# EasyEDA Pro project BLDCV6-nerdyintern.eprj, board PCB1_1
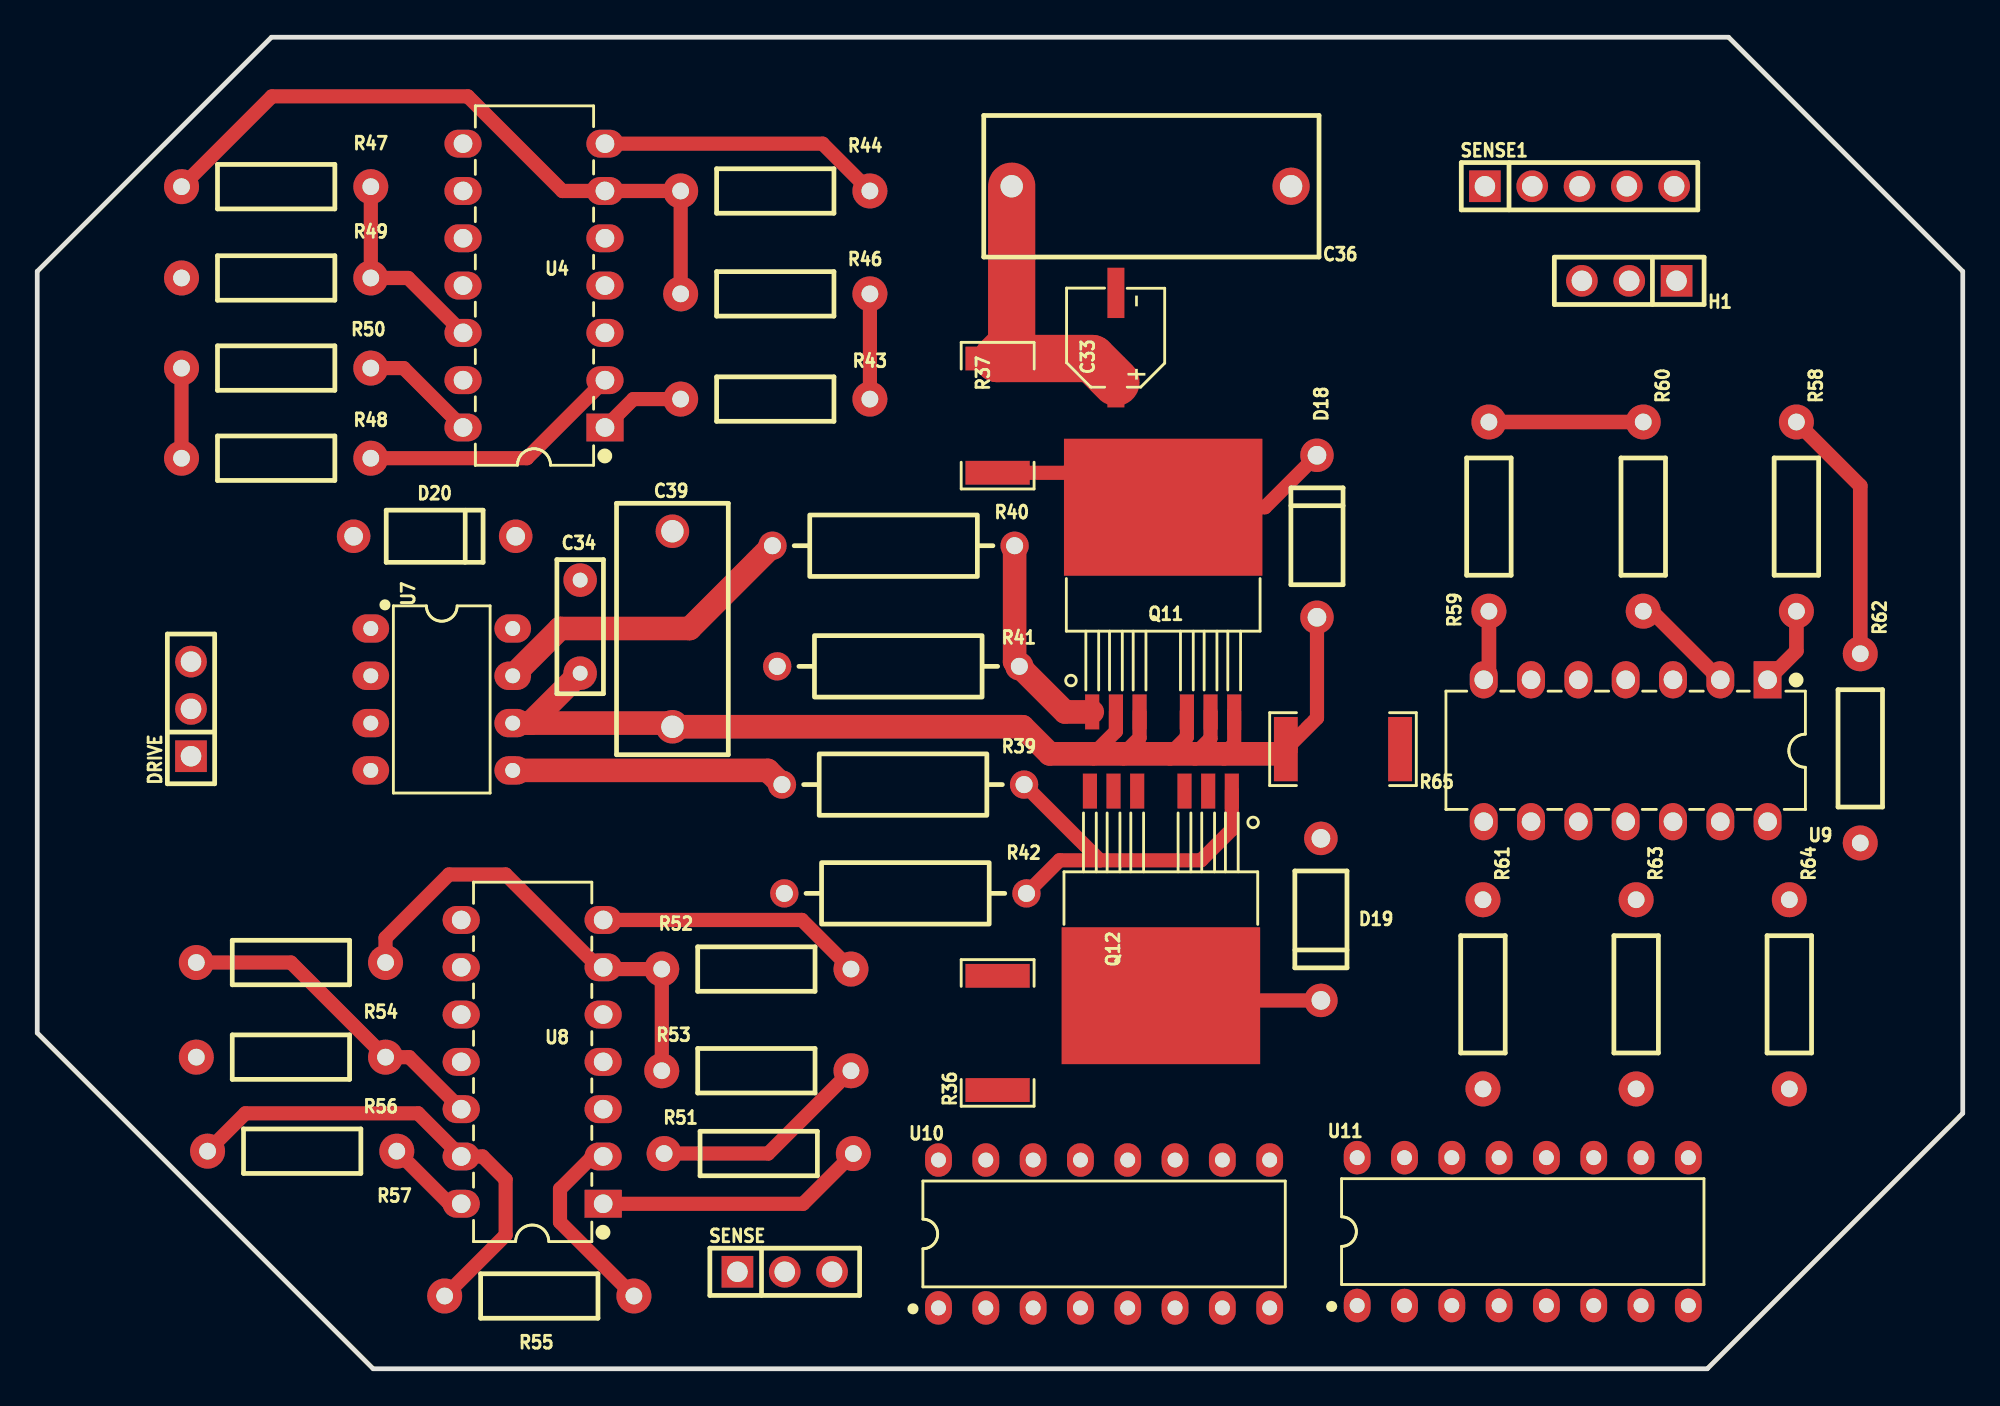
[diagram p13: board, top side]
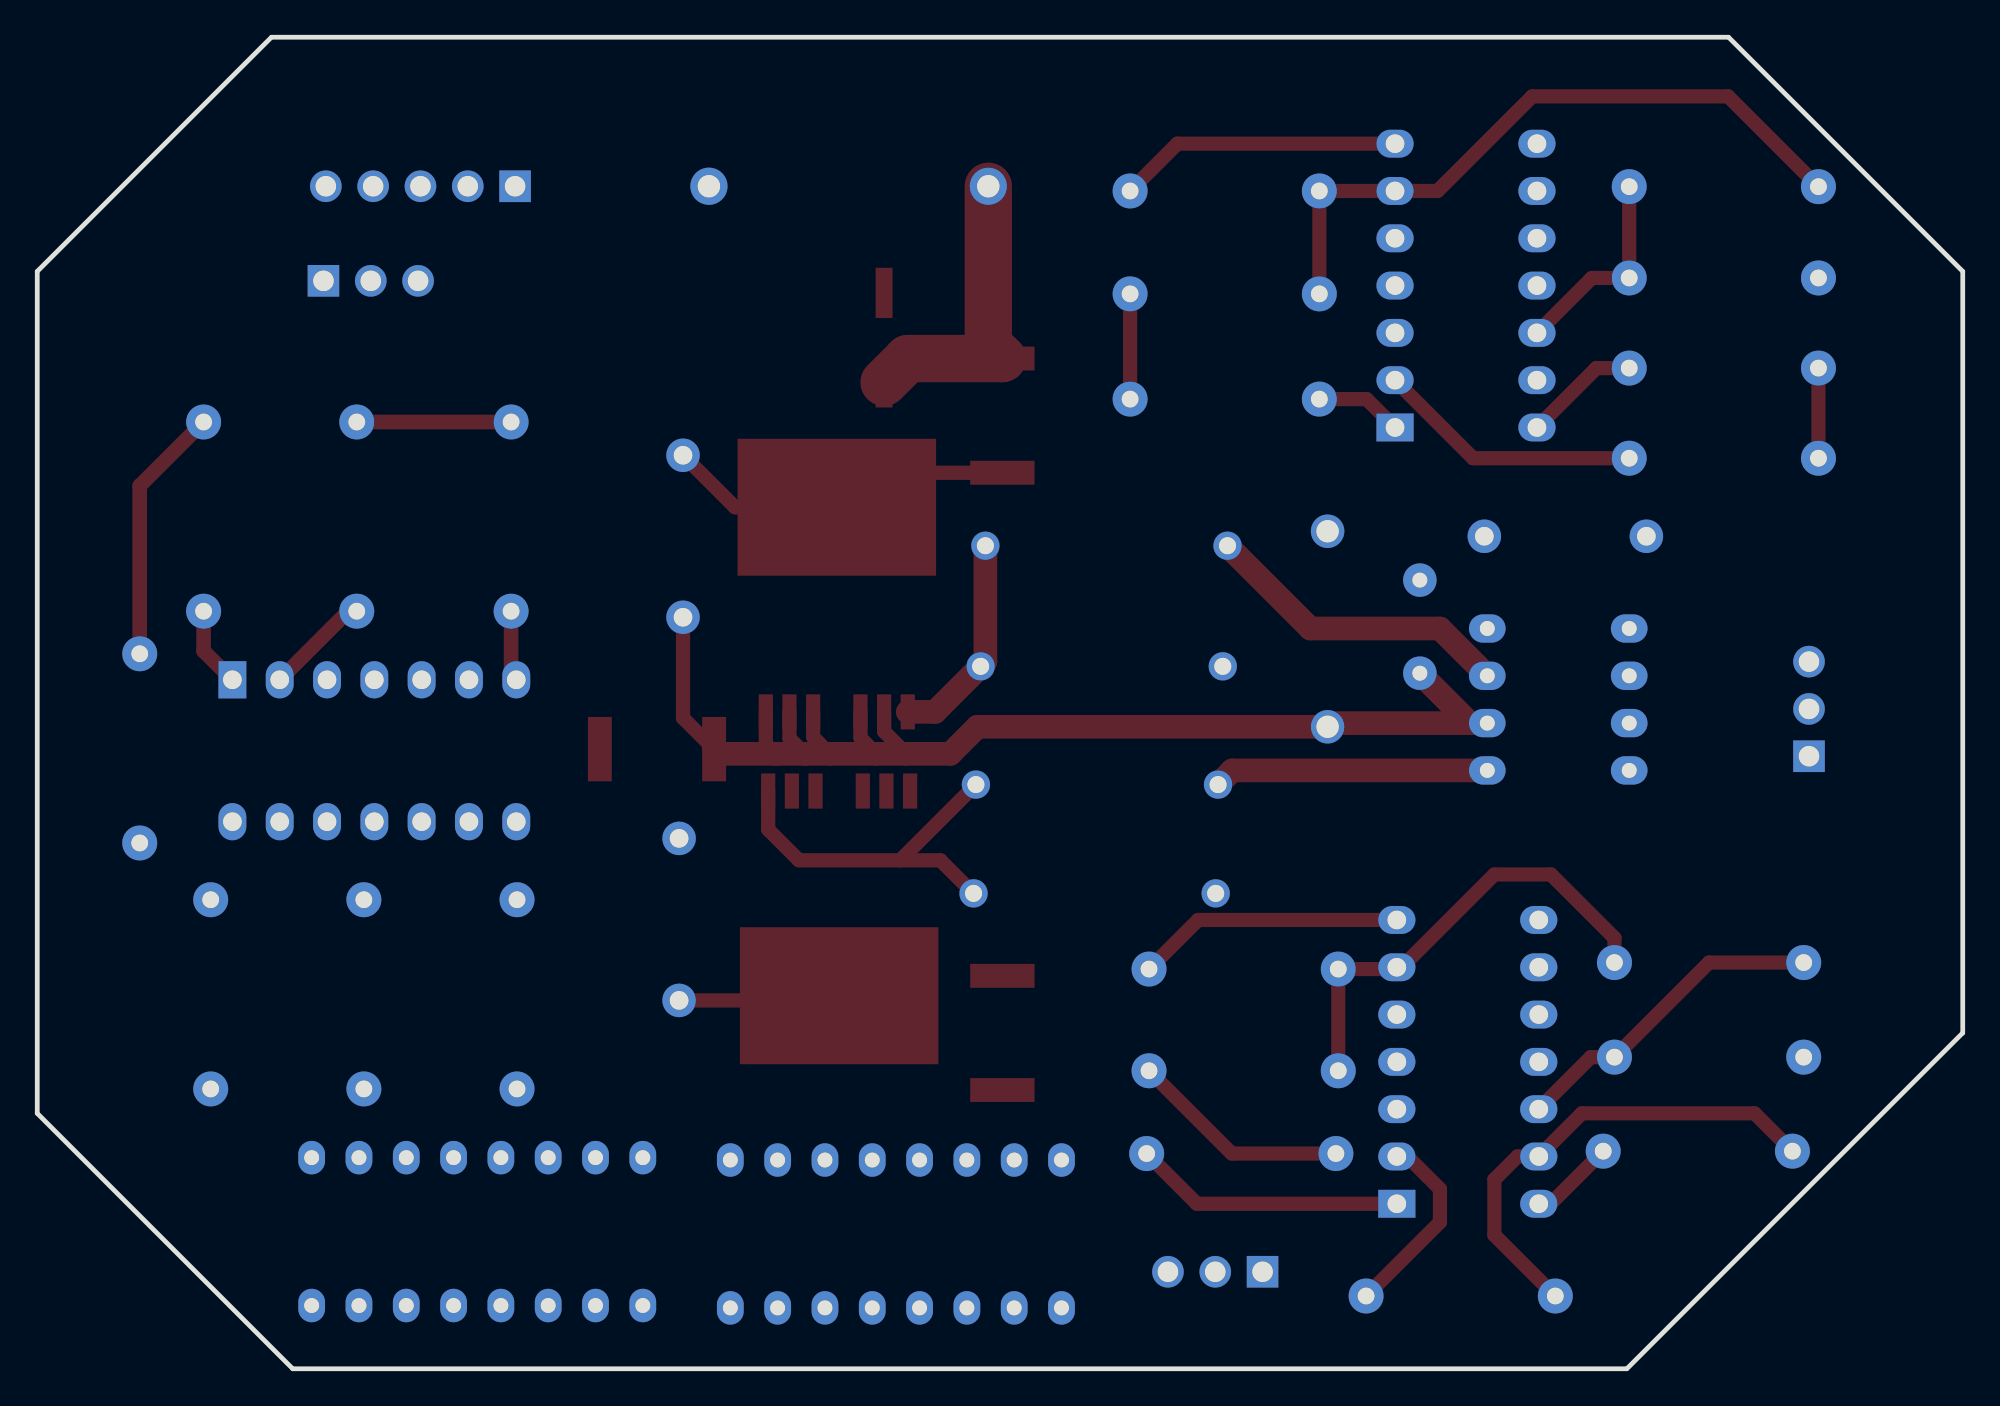
[diagram p14: board, bottom side, seen from below]

Outline 103.38 x 71.5 mm; copper layers: Top Layer, Bottom Layer. Coordinates in mm from the lower left corner of the outline.
Outline path: 0,58.93 0,18.03 18.03,0 89.66,0 103.38,13.72 103.38,58.93 90.8,71.5 12.57,71.5 0,58.93
Stack: Top Layer 0.035mm / Dielectric1 1.51mm FR4 er 4.5 / Bottom Layer 0.035mm

## Design rules (mm)
template: JLCPCB Capability(Two Layers Board)
spacing copperThickness1oz (default): track to track 0.102, other pairs 0.152 to 0.3
spacing copperThickness2oz: track to track 0.203, other pairs 0.152 to 0.3
track width copperThickness1oz (default): min 0.127, default 0.254, max 2.54
track width copperThickness2oz: min 0.203, default 0.254, max 2.54
differential pair differentialPair (default): width min 0.127, default 0.254, max 2.54; gap min 0.152, default 0.152
via viaSize (default): diameter min 0.5, default 0.61, max 10; hole min 0.3, default 0.305, max 6.3

## Placement (name value [footprint] x y rotation side)
C33  10uF  [CAP-SMD_BD5.0-L5.3-W5.3-LS6.3-FD]  57.91 55.37 90 top
C34  1uF  [CAP-TH_L7.2-W2.5-P5.00-D0.6]  29.15 39.85 90 top
C36  330nF  [CAP-TH_L18.0-W7.5-P15.00-D0.8]  59.82 63.5 180 top
C39  15nF  [CAP-TH_L13.5-W5.5-P10.50-D1.2]  34.1 39.72 90 top
D18  -  [DO-41_BD2.4-L4.7-P8.70-D0.9-RD]  68.71 44.7 270 top
D19  -  [DO-41_BD2.4-L4.7-P8.70-D0.9-RD]  68.92 24.13 90 top
D20  -  [DO-41_BD2.4-L4.7-P8.70-D0.9-RD]  21.34 44.7 180 top
DRIVE  -  [HDR-TH_3P-P2.54-V-M]  8.26 35.43 90 top
H1  -  [HDR-TH_3P-P2.54-V-M]  85.47 58.42 180 top
Q11  IRFS7530TRL7PP  [D2PAK-7_L10.6-W9.6-P1.27-LS15.9-BR]  60.45 40.77 270 top
Q12  IRFS7530TRL7PP  [D2PAK-7_L10.6-W9.6-P1.27-LS15.9-BR]  60.33 25.53 90 top
R36  5mΩ  [R2512]  51.56 18.03 90 top
R37  5mΩ  [R2512]  51.56 51.18 90 top
R39  [6-10]  [RES-TH_BD3.3-L9.0-P13.00-D0.6]  46.48 31.37 0 top
R40  [6-10]  [RES-TH_BD3.3-L9.0-P13.00-D0.6]  45.97 44.2 180 top
R41  10k  [RES-TH_BD3.3-L9.0-P13.00-D0.6]  46.23 37.72 180 top
R42  10k  [RES-TH_BD3.3-L9.0-P13.00-D0.6]  46.61 25.53 180 top
R43  10kΩ  [R_AXIAL-0.4]  39.62 52.07 180 top
R44  10kΩ  [R_AXIAL-0.4]  39.62 63.25 180 top
R46  10kΩ  [R_AXIAL-0.4]  39.62 57.72 0 top
R47  10kΩ  [R_AXIAL-0.4]  12.83 63.48 0 top
R48  10kΩ  [R_AXIAL-0.4]  12.83 48.9 180 top
R49  10kΩ  [R_AXIAL-0.4]  12.83 58.57 180 top
R50  10kΩ  [R_AXIAL-0.4]  12.83 53.74 180 top
R51  10kΩ  [R_AXIAL-0.4]  38.73 11.56 0 top
R52  10kΩ  [R_AXIAL-0.4]  38.61 21.46 180 top
R53  10kΩ  [R_AXIAL-0.4]  38.61 16 0 top
R54  10kΩ  [R_AXIAL-0.4]  13.62 21.81 180 top
R55  10kΩ  [R_AXIAL-0.4]  26.95 3.91 180 top
R56  10kΩ  [R_AXIAL-0.4]  13.62 16.73 180 top
R57  10kΩ  [R_AXIAL-0.4]  14.22 11.68 180 top
R58  10kΩ  [R_AXIAL-0.4]  94.45 45.76 270 top
R59  10kΩ  [R_AXIAL-0.4]  77.94 45.76 90 top
R60  10kΩ  [R_AXIAL-0.4]  86.22 45.76 270 top
R61  10kΩ  [R_AXIAL-0.4]  77.62 20.11 270 top
R62  10kΩ  [R_AXIAL-0.4]  97.88 33.31 270 top
R63  10kΩ  [R_AXIAL-0.4]  85.84 20.11 270 top
R64  10kΩ  [R_AXIAL-0.4]  94.07 20.11 270 top
R65  5mΩ  [R2512]  70.1 33.27 180 top
SENSE  -  [HDR-TH_3P-P2.54-V-M]  40.13 5.21 0 top
SENSE1  -  [HDR-TH_5P-P2.54-V-M]  82.8 63.5 0 top
U4  LM324N  [DIP-14_L19.3-W7.0-P2.54-LS7.6-BL]  26.67 58.17 90 top
U7  IR2104PBF  [DIP-8_L9.9-W6.6-P2.54-LS7.62-BL]  21.72 35.94 270 top
U8  LM324N  [DIP-14_L19.3-W7.0-P2.54-LS7.6-BL]  26.57 16.48 90 top
U9  LM324N  [DIP-14_L19.3-W7.0-P2.54-LS7.6-BL]  85.28 33.19 180 top
U10  74HC4051N  [PDIP-16_L19.3-W6.4-P2.54-LS7.94-BL]  57.28 7.24 0 top
U11  74HC4051N  [PDIP-16_L19.3-W6.4-P2.54-LS7.94-BL]  79.76 7.37 0 top

## Footprints (pads in the part's own frame, mm; a bottom-side part is the same pattern mirrored in y, then rotated)
CAP-SMD_BD5.0-L5.3-W5.3-LS6.3-FD
  rect 2.7x0.91 smd: 1(-2.4,0) 2(2.4,0)
CAP-TH_L7.2-W2.5-P5.00-D0.6
  round 1.8 hole 0.8: 1(-2.499,0) 2(2.499,0)
CAP-TH_L13.5-W5.5-P10.50-D1.2
  round 1.8 hole 1.2: 1(-5.25,0) 2(5.25,0)
CAP-TH_L18.0-W7.5-P15.00-D0.8
  round 2 hole 1.2: 1(-7.5,0) 2(7.5,0)
D2PAK-7_L10.6-W9.6-P1.27-LS15.9-BR
  rect 1.887x0.762 smd: 1(5.495,-3.81) 2(5.495,-2.54) 3(5.495,-1.27) 5(5.495,1.27) 6(5.495,2.54) 7(5.495,3.81)
  rect 7.356x10.66 smd: 4(-5.495,0)
DIP-8_L9.9-W6.6-P2.54-LS7.62-BL
  oval 1.524x1.97 hole 0.8: 1(-3.81,-3.81) 2(-1.27,-3.81) 3(1.27,-3.81) 4(3.81,-3.81) 5(3.81,3.81) 6(1.27,3.81) 7(-1.27,3.81) 8(-3.81,3.81)
DIP-14_L19.3-W7.0-P2.54-LS7.6-BL
  rect 1.5x2 hole 1: 1(-7.62,-3.81)
  oval 1.5x2 hole 1: 2(-5.08,-3.81) 3(-2.54,-3.81) 4(0,-3.81) 5(2.54,-3.81) 6(5.08,-3.81) 7(7.62,-3.81) 8(7.62,3.81) 9(5.08,3.81) 10(2.54,3.81) 11(0,3.81) 12(-2.54,3.81) 13(-5.08,3.81) 14(-7.62,3.81)
DO-41_BD2.4-L4.7-P8.70-D0.9-RD
  round 1.8 hole 1: 1(-4.35,0) 2(4.35,0)
HDR-TH_3P-P2.54-V-M
  rect 1.7x1.7 hole 1.1: 1(-2.54,0)
  round 1.7 hole 1.1: 2(0,0) 3(2.54,0)
HDR-TH_5P-P2.54-V-M
  rect 1.7x1.7 hole 1.1: 1(-5.08,0)
  round 1.7 hole 1.1: 2(-2.54,0) 3(0,0) 4(2.54,0) 5(5.08,0)
PDIP-16_L19.3-W6.4-P2.54-LS7.94-BL
  oval 1.44x1.8 hole 0.8: 1(-8.89,-3.97) 2(-6.35,-3.97) 3(-3.81,-3.97) 4(-1.27,-3.97) 5(1.27,-3.97) 6(3.81,-3.97) 7(6.35,-3.97) 8(8.89,-3.97) 9(8.89,3.97) 10(6.35,3.97) 11(3.81,3.97) 12(1.27,3.97) 13(-1.27,3.97) 14(-3.81,3.97) 15(-6.35,3.97) 16(-8.89,3.97)
R2512
  rect 1.282x3.456 smd: 1(-3.067,0) 2(3.067,0)
R_AXIAL-0.4
  round 1.879 hole 0.899: 1(-5.08,0) 2(5.08,0)
RES-TH_BD3.3-L9.0-P13.00-D0.6
  round 1.524 hole 0.914: 1(-6.5,0) 2(6.5,0)

## Nets
As in the schematic.

Pads without a net: U4 8 9 10; U8 8 9 10; U9 8 9 10; U10 1 2 3 4 5 6 7 8 9 10 11 12 13 14 15 16; U11 1 2 3 4 5 6 7 8 9 10 11 12 13 14 15 16

## Routing (per net, layer and track width the routed paths; a pad name or vN(x,y) marks a point on that pad's centre or on a via; arc(x,y) is an arc through that point)
VCC: length 16.4
  Top Layer w2.54: C36.2 52.32,55 R37.2 56.64,54.25 C33.1
HS1_SENSE: length 19.1
  Top Layer w0.762: D18.1 65.92,46.26 Q11.4 58.6,48.11 R37.1
HS_SENSE_OUT: length 4.8
  Top Layer w0.762: R48.2 R50.2
HSO: length 16.8
  Top Layer w1.27: U7.7 28.07,39.75 35.03,39.75 R40.2
LS_SENSE_OUT: length 25.9
  Top Layer w0.762: R57.2 11.18,13.72 20.45,13.72 U8.13 23.91,11.4 25.15,10.16 25.15,7.18 R55.2
LSO: length 14.8
  Top Layer w1.27: R39.1 39.22,32.13 U7.5
SWITCH_NODE: length 75.6
  Top Layer w0.762: 63.72,33.02 64.26,33.56 Q11.7 ; Q11.5 61.72,33.92 60.82,33.02 ; 62.16,33.02 62.99,33.85 Q11.6 ; 58.32,33.02 59.18,33.88 Q11.3 ; R65.2 68.71,34.94 D18.2 ; Q12.4 60.58,19.78 D19.1 ; Q11.2 57.91,34.23 56.71,33.02
  Top Layer w1.27: U7.6 26.47,34.67 ; 26.47,34.67 33.9,34.67 C39.1 52.9,34.47 54.36,33.02 66.78,33.02 R65.2 ; 26.47,34.67 C34.1
$1N6814: length 20.3
  Top Layer w0.762: R39.2 57.05,27.31 ; 57.05,27.31 54.89,27.31 R42.1 ; 57.05,27.31 62.48,27.31 64.14,28.96 Q12.1
$1N6817: length 11.5
  Top Layer w1.27: Q11.1 55.18,35.27 R41.1 52.47,37.97 R40.1
$1N9323: length 4.7
  Top Layer w0.762: R43.2 32,52.07 U4.1
$1N9349: length 15.3
  Top Layer w0.762: U4.7 42.16,65.79 R44.1
$1N9578: length 36.4
  Top Layer w0.762: R46.1 R44.2 U4.6 28.19,63.25 23.11,68.33 12.6,68.33 R47.1
$1N9592: length 20
  Top Layer w0.762: U4.2 26.29,48.9 R48.1 ; R46.2 R43.1
$1N9659: length 11.1
  Top Layer w0.762: R47.2 R49.1 19.91,58.57 U4.12
$1N9763: length 6.3
  Top Layer w0.762: R50.1 19.67,53.74 U4.14
$1N10683: length 14.5
  Top Layer w0.762: U8.1 41.12,8.86 R51.2
$1N10684: length 14.4
  Top Layer w0.762: U8.7 41.05,24.1 R52.1
$1N10685: length 25.1
  Top Layer w0.762: R54.1 18.7,23.13 22.11,26.54 25.15,26.54 30.13,21.56 U8.6 30.48,21.46 R52.2 R53.1
$1N10686: length 22.3
  Top Layer w0.762: R53.2 39.24,11.56 33.66,11.56 ; U8.2 29.81,11.4 28.07,9.65 28.07,7.87 R55.1
$1N10689: length 17.5
  Top Layer w0.762: R54.2 13.62,21.81 R56.1 19.97,16.73 U8.12
$1N10691: length 4.6
  Top Layer w0.762: U8.14 22.13,8.86 R57.1
$1N10984: length 4.3
  Top Layer w0.787: R58.2 94.45,38.54 U9.1
$1N10985: length 3.8
  Top Layer w0.787: U9.7 77.94,37.27 R59.1
$1N10986: length 8.3
  Top Layer w0.787: R59.2 R60.1
$1N10987: length 19.5
  Top Layer w0.787: R60.2 86.68,40.68 U9.2 ; R62.1 97.88,47.41 R58.1
